# EAGLE design supply (EAGLE 7.4.0)
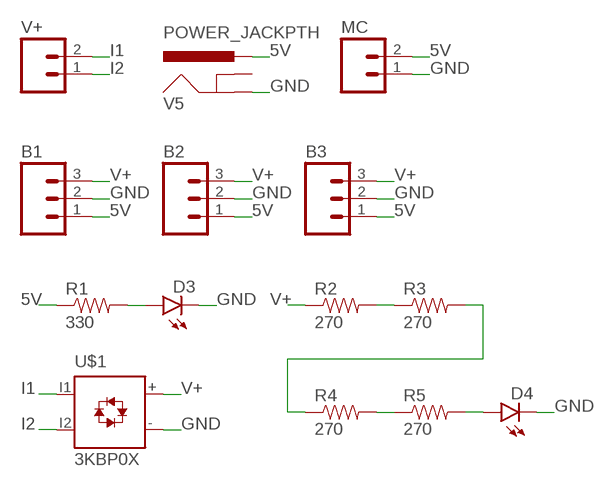
[diagram p0: schematic, sheet 1]

## Parts
B1  M03PTH  [1X03]
B2  M03PTH  [1X03]
B3  M03PTH  [1X03]
D3  LED10MM  [LED10MM]
D4  LED10MM  [LED10MM]
MC  M02PTH  [1X02]
R1  330  1KOHM-1/4W-5%(PTH)HORIZ-KIT  [AXIAL-0.3EZ]
R2  270  1KOHM-1/4W-5%(PTH)HORIZ-KIT  [AXIAL-0.3EZ]
R3  270  1KOHM-1/4W-5%(PTH)HORIZ-KIT  [AXIAL-0.3EZ]
R4  270  1KOHM-1/4W-5%(PTH)HORIZ-KIT  [AXIAL-0.3EZ]
R5  270  1KOHM-1/4W-5%(PTH)HORIZ-KIT  [AXIAL-0.3EZ]
U$1  3KBP0X  [3KBP0X]
V5  POWER_JACKPTH  [POWER_JACK_PTH]
V+  M025MM  [SCREWTERMINAL-5MM-2]

## Nets
5V: B1.1 B2.1 B3.1 MC.2 R1.P$1 V5.PWR
GND: B1.2 B2.2 B3.2 D3.C D4.C MC.1 U$1.- V5.GND
I1: U$1.I1 V+.2
I2: U$1.I2 V+.1
N$1: R2.P$2 R3.P$1
N$2: D4.A R5.P$2
N$3: R3.P$2 R4.P$1
N$4: D3.A R1.P$2
N$5: R4.P$2 R5.P$1
V+: B1.3 B2.3 B3.3 R2.P$1 U$1.+
Unconnected: V5.GNDBREAK

## Library data of the parts
B1-B3 = SparkFun-Connectors:M03: Header 3 Standard 3-pin 0.1" header. Use with straight break away headers (SKU : PRT-00116), right angle break away headers (PRT-00553), swiss pins (PRT-00743), machine pins (PRT-00117), and female headers (PRT-00115). Molex polarized connector foot print use with SKU : PRT-08232 with associated crimp pins and housings.
D3 D4 = SparkFun-LED:LED: LEDs Standard schematic elements and footprints for 5mm, 3mm, 1206, and 0603 sized LEDs. 5mm - Spark Fun Electronics SKU : COM-00529 (and others)
MC = SparkFun-Connectors:M02: Standard 2-pin 0.1" header. Use with - straight break away headers ( PRT-00116) - right angle break away headers (PRT-00553) - swiss pins (PRT-00743) - machine pins (PRT-00117) - female headers (PRT-00115) Molex polarized connector foot print use with: PRT-08233 with associated crimp pins and housings. 2.54_SCREWTERM for use with PRT-10571. 3.5mm Screw Terminal footprints for PRT-08084 5mm Screw Terminal footprints for use with PRT-08432
R1-R5 = SparkFun-Resistors:1KOHM-1/4W-5%(PTH): RES-08380; PROD_ID: RES-08380; VALUE: 1k
U$1 = custom-parts:3KBP0X
V5 = SparkFun-Connectors:POWER_JACK: Power Jack This is the standard 5.5mm barrel jack for power. The PTH is the most common, proven, reliable, footprint. The Slot footprint only works if the mill layer is transmitted to the PCB fab house so be warned. Mating wall wart : TOL-00298 (and others); PROD_ID: CONN-08197
V+ = SparkFun-Connectors:M02: Standard 2-pin 0.1" header. Use with - straight break away headers ( PRT-00116) - right angle break away headers (PRT-00553) - swiss pins (PRT-00743) - machine pins (PRT-00117) - female headers (PRT-00115) Molex polarized connector foot print use with: PRT-08233 with associated crimp pins and housings. 2.54_SCREWTERM for use with PRT-10571. 3.5mm Screw Terminal footprints for PRT-08084 5mm Screw Terminal footprints for use with PRT-08432; STOREFRONT_ID: PRT-08432

## Board
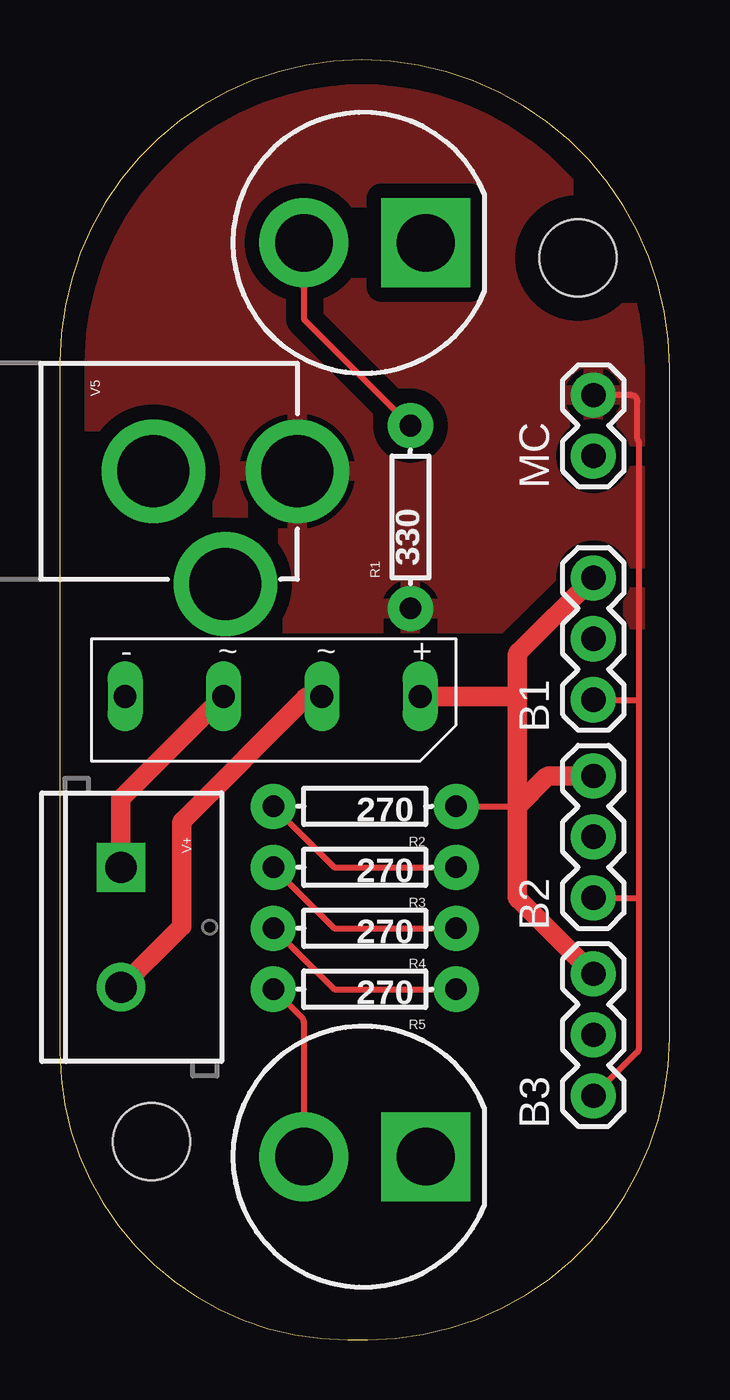
[diagram p1: board, top side]
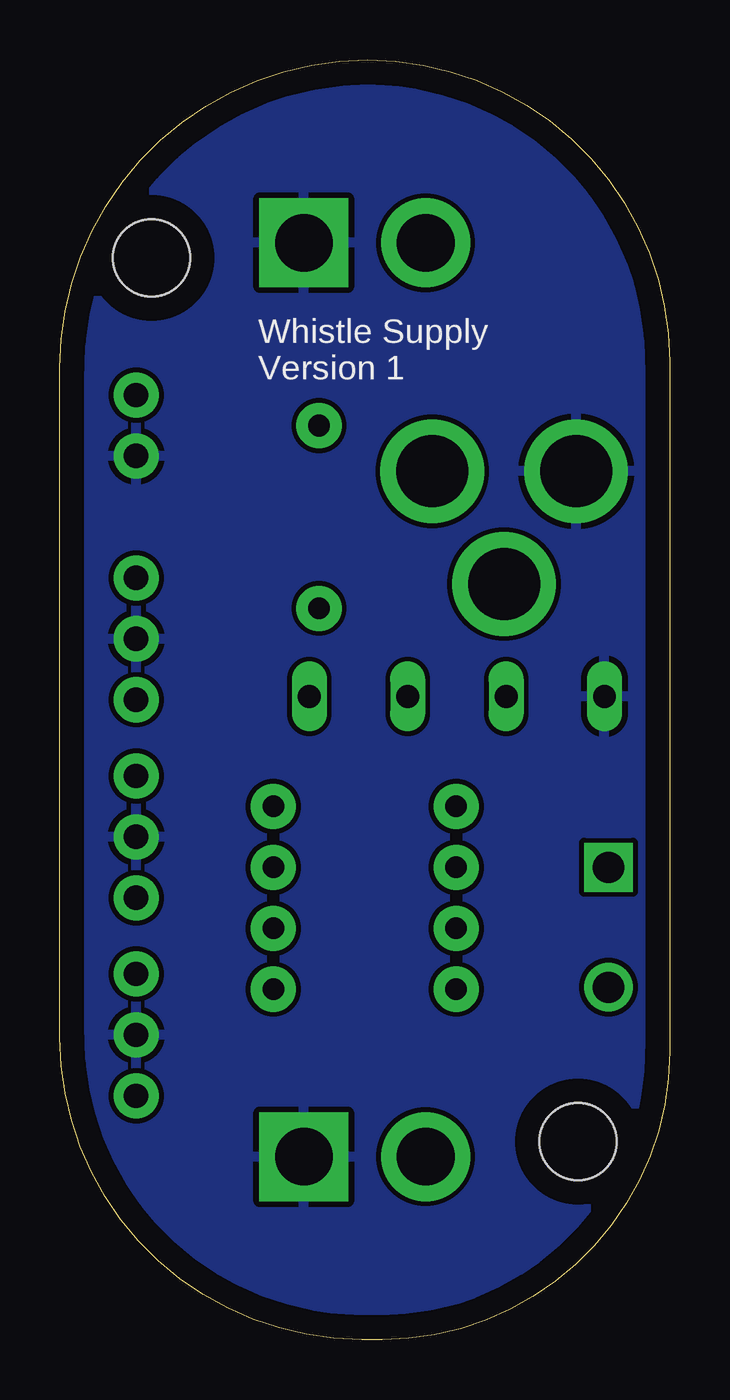
[diagram p2: board, bottom side, seen from below]

Size 25.4 x 53.34 mm. Coordinates in mm from the lower left corner, seen from the top.
Outline: 11.98,0 12.83,0 arc90 25.4,12.57 25.4,40.51 arc90 12.57,53.34 arc90 0,40.77 0,11.98 arc90 11.98,0
Copper layers (1*16): Top 0.035mm / dielectric 1.5mm / Bottom 0.035mm
Design rules "default": minimum track width 10mil, minimum drill 24mil, track to track 8mil, track to pad 8mil, pad to pad 8mil, via to via 8mil, smd to smd 8mil, copper to edge 40mil, drill to drill 8mil, minimum pad ring 10mil, minimum via ring 8mil, stop-mask expansion 4mil, vias tented up to drill 0mil, thermal gap 10mil
Holes 3.2 mm at 21.59,45.09 3.81,8.25

### Footprints (pad centres in the part's own frame; a part is rotated, then mirrored left to right if it is on the bottom)
1X03 = drill 1.016 pad 1.88: 1 0,0; 2 2.54,0; 3 5.08,0
LED10MM = drill 2.4 pad 3.7: A 2.54,0 | drill 2.4 pad 3.7 square: C -2.54,0
1X02 = drill 1.016 pad 1.88: 1 0,0; 2 2.54,0
AXIAL-0.3EZ = drill 0.9 pad 1.88: P$1 -3.81,0; P$2 3.81,0
3KBP0X = drill 0.95 long: + 1.5,2.4; - 13.8,2.4; I1 5.6,2.4; I2 9.7,2.4
POWER_JACK_PTH = drill 2.997 pad 4.318: GND 0,7.7; GNDBREAK 4.7,10.7; PWR 0,13.7
SCREWTERMINAL-5MM-2 = drill 1.3 pad 2.032 square: 1 0,0 | drill 1.3 pad 2.032: 2 5,0

### Placement (x,y rotation side)
B1  22.23,26.67 90 top
B2  22.23,18.41 90 top
B3  22.23,10.16 90 top
D3  12.7,45.72 180 top
D4  12.7,7.62 180 top
MC  22.23,36.83 90 top
R1  14.6,34.29 90 top
R2  12.7,22.23 180 top
R3  12.7,19.69 180 top
R4  12.7,17.14 180 top
R5  12.7,14.61 180 top
U$1  16.51,29.21 180 top
V5  -3.81,36.2 270 top
V+  2.54,19.69 270 top

### Tracks (layer width: path | path; a pad name or v marks a point on that pad's centre or on a via)
5V
  Top 0.254: B3.1 24.06,11.99 arc45 24.13,12.17 24.13,18.41 | 24.13,18.41 24.13,26.67 | B2.1 24.13,18.41 | B1.1 24.13,26.67 | 24.13,26.67 24.13,37.36 arc45 24.06,37.54 24.06,39.12 arc90 23.8,39.37 MC.2
  pour Top (isolate 0.61): 0,29.84 25.4,29.84 25.4,53.34 0,53.34
GND
  pour Bottom: 0,0 0,53.34 25.4,53.34 25.4,0
I1
  Top 0.813: V+.2 5.08,17.23 5.08,21.48 arc-45 5.15,21.66 10.23,26.74 arc-45 10.4,26.81 U$1.I1
I2
  Top 0.813: V+.1 2.54,22.54 U$1.I2
N$1
  Top 0.254: R2.P$2 11.43,19.69 R3.P$1
N$2
  Top 0.254: D4.A 10.16,13.23 arc45 10.09,13.41 R5.P$2
N$3
  Top 0.254: R3.P$2 11.43,17.14 R4.P$1
N$4
  Top 0.254: D3.A 10.16,42.55 R1.P$2
N$5
  Top 0.254: R4.P$2 11.43,14.61 R5.P$1
V+
  Top 0.254: R2.P$1 19.05,22.23
  Top 0.813: B1.3 19.12,28.65 arc45 19.05,28.47 19.05,26.81 | 19.05,26.81 19.05,22.23 | 19.05,22.23 19.05,18.52 arc45 19.12,18.34 B3.3 | 19.05,22.23 20.25,23.42 arc-45 20.42,23.5 B2.3 | U$1.+ 19.05,26.81

### Text on the board
bPlace: Whistle Supply / Version 1